# Altium schematic sheet usb_uart.SchDoc
size A
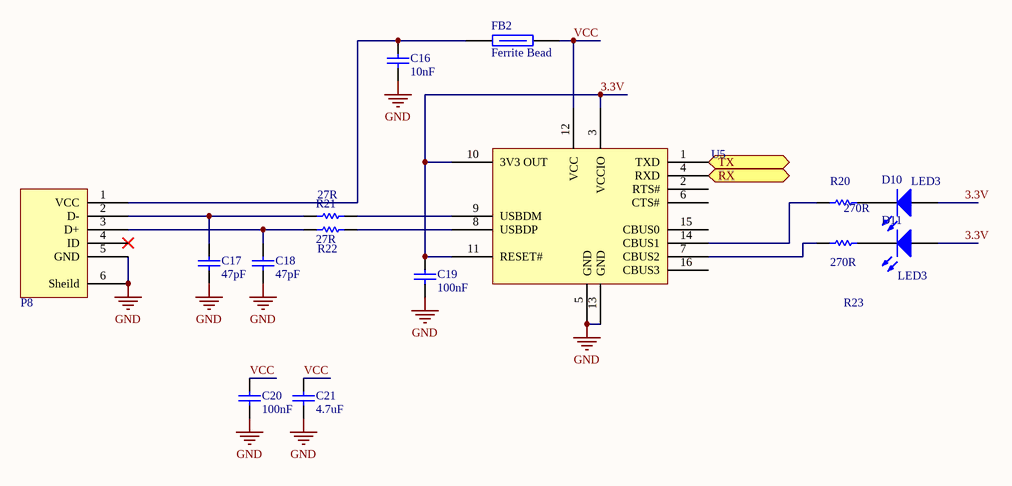
[diagram p0: usb_uart.SchDoc]

## Parts
C16  value 10nF  [1608[0603]]  (hidden comment: Cap)
C17  value 47pF  [1608[0603]]  (hidden comment: Cap)
C18  value 47pF  [1608[0603]]  (hidden comment: Cap)
C19  value 100nF  [1608[0603]]  (hidden comment: Cap)
C20  value 100nF  [1608[0603]]  (hidden comment: Cap)
C21  value 4.7uF  [1608[0603]]  (hidden comment: Cap)
D10  LED3  [LED 0805]
D11  LED3  [LED 0805]
FB2  Ferrite Bead  [0603]
P8  USB Micro B  [USB micro B]  (value not drawn)
R20  value 270R  [J1-0603]  (hidden comment: Res)
R21  value 27R  [J1-0603]  (hidden comment: Res)
R22  value 27R  [J1-0603]  (hidden comment: Res)
R23  value 270R  [J1-0603]  (hidden comment: Res)
U5  FT230XS  [SSOP16_N]  (value not drawn)

## Ports
RX, TX

## Nets
GND: C16.1 C17.1 C18.1 C19.1 C20.1 C21.1 P8.5(GND) P8.6(Sheild) U5.5(GND) U5.13(GND)
3.3V: C19.2 D10.1(A) D11.1(A) U5.3(VCCIO) U5.10(3V3_OUT) U5.11(RESET#)
RX: U5.4(RXD) ; port RX
TX: U5.1(TXD) ; port TX
VCC: C20.2 C21.2 FB2.1 U5.12(VCC)
NetC16_2: C16.2 FB2.2 P8.1(VCC)
NetC17_2: C17.2 P8.2(D-) R21.2
NetC18_2: C18.2 P8.3(D+) R22.2
NetD10_2: D10.2(K) R20.1
NetD11_2: D11.2(K) R23.1
NetR20_2: R20.2 U5.14(CBUS1)
NetR21_1: R21.1 U5.9(USBDM)
NetR22_1: R22.1 U5.8(USBDP)
NetR23_2: R23.2 U5.7(CBUS2)

Not connected (* = marked no-connect by the designer): P8 4(ID)*; U5 2(RTS#) 6(CTS#) 15(CBUS0) 16(CBUS3)

## Library data of the parts
C16-C21 = Cap: Capacitor; Published: 8-Jun-2000; LatestRevisionDate: 17-Jul-2002; LatestRevisionNote: Re-released for DXP Platform.; PackageReference: RAD-0.3; Publisher: Altium Limited; PackageDescription: Radial Cap, Thru-Hole; 2 Leads; 0.3 in Pin Spacing
D10 D11 = LED3: Typical BLUE SiC LED; Published: 8-Jun-2000; LatestRevisionDate: 17-Dec-2003; LatestRevisionNote: PCB Footprint replaced.; DatasheetVersion: 16-Apr-2002; PackageVersion: 16-Apr-2002; PackageReference: 3.5X2.8X1.9; Publisher: Altium Limited; PackageDescription: SM LED; 2 C-Bend Leads; Body 3.5 x 2.8 x 1.9 mm, inc leads (LxWxH typ)
R20-R23 = Res: Resistor 0805; Published: 8-Jun-2000; LatestRevisionDate: 17-Jul-2002; LatestRevisionNote: Re-released for DXP Platform.; PackageReference: AXIAL-0.3; Publisher: Altium Limited; PackageDescription: Axial Device, Thru-Hole; 2 Leads; 0.3 in Pin Spacing